# EAGLE schematic CAN_Shield_HS (EAGLE 7.5.0)
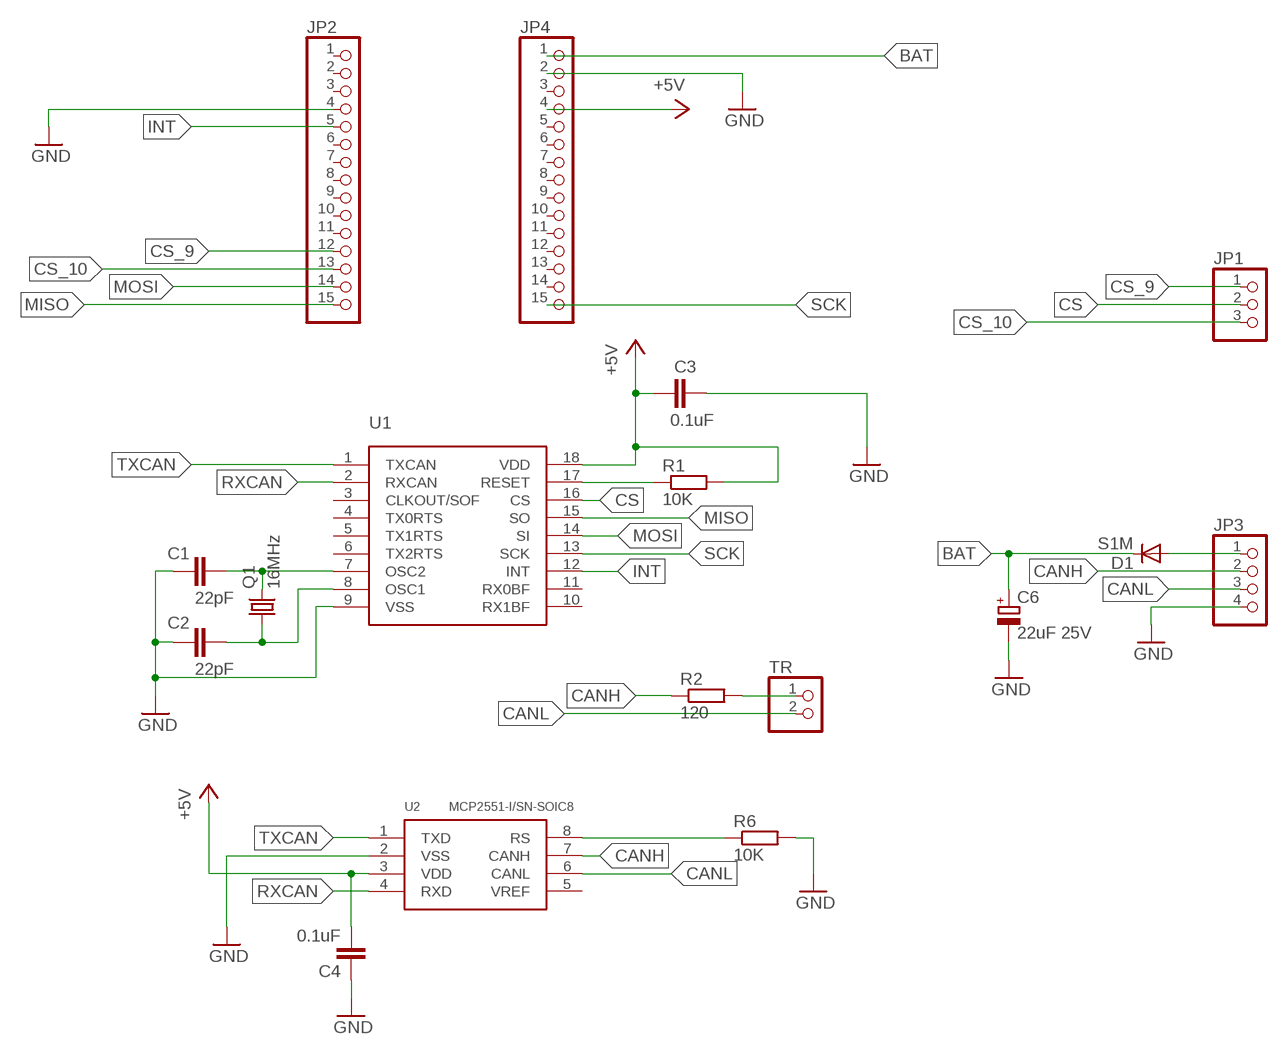
[diagram p0: schematic, sheet 1]

## Parts
C1  22pF  C-EUC0805  [C0805]
C2  22pF  C-EUC0805  [C0805]
C3  0.1uF  C-EUC0805  [C0805]
C4  0.1uF  C-EUC0805  [C0805]
C6  22uF 25V  CPOL-EUSMCC  [SMC_C]
D1  S1M  [SMA]
JP1  PINHD-1X3  [1X03]
JP2  PINHD-1X15  [1X15]
JP3  PINHD-1X4-1  [1X04]
JP4  PINHD-1X15  [1X15]
Q1  16MHz  CRYSTALHC49S  [HC49/S]
R1  10K  R-EU_R0805  [R0805]
R2  120  R-EU_R0805  [R0805]
R6  10K  R-EU_R0805  [R0805]
TR  PINHD-1X2  [1X02]
U1  MCP2515  [SO18-1]
U2  MCP2551-I/SN-SOIC8  INTERFACE-MCP2551-I/SN(SOIC8)  [SOIC8-1.27-5X4MM]

## Nets
+5V: C3.1 C4.2 JP4.4 R1.2 U1.18(VDD) U2.3(VDD)
BAT: C6.+ D1.C JP4.1
CANH: JP3.2 R2.1 U2.7(CANH)
CANL: JP3.3 TR.2 U2.6(CANL)
CS: JP1.2 U1.16(CS)
CS_9: JP1.1 JP2.12
CS_10: JP1.3 JP2.13
GND: C1.1 C2.1 C3.2 C4.1 C6.- JP2.4 JP3.4 JP4.2 R6.2 U1.9(VSS) U2.2(VSS)
INT: JP2.5 U1.12(INT)
MISO: JP2.15 U1.15(SO)
MOSI: JP2.14 U1.14(SI)
N$1: R2.2 TR.1
N$3: C1.2 Q1.2 U1.7(OSC2)
N$4: D1.A JP3.1
N$5: C2.2 Q1.1 U1.8(OSC1)
N$7: R1.1 U1.17(RESET)
N$12: R6.1 U2.8(RS)
RXCAN: U1.2(RXCAN) U2.4(RXD)
SCK: JP4.15 U1.13(SCK)
TXCAN: U1.1(TXCAN) U2.1(TXD)
Unconnected: JP2.1 JP2.2 JP2.3 JP2.6 JP2.7 JP2.8 JP2.9 JP2.10 JP2.11 JP4.3 JP4.5 JP4.6 JP4.7 JP4.8 JP4.9 JP4.10 JP4.11 JP4.12 JP4.13 JP4.14 U1.3(CLKOUT/SOF) U1.4(TX0RTS) U1.5(TX1RTS) U1.6(TX2RTS) U1.10(RX1BF) U1.11(RX0BF) U2.5(VREF)

## Library data of the parts
C1-C4 = rcl:C-EU: CAPACITOR, European symbol
C6 = rcl:CPOL-EU: POLARIZED CAPACITOR, European symbol
D1 = diode:S1M
JP1 = CAN_Shiel_Lib:PINHD-1X3: PIN HEADER
JP2 JP4 = CAN_Shiel_Lib:PINHD-1X15: PIN HEADER
JP3 = CAN_Shiel_Lib:PINHD-1X4-1: PIN HEADER
Q1 = crystal:CRYSTAL: CRYSTAL; OC_FARNELL: 1667008; OC_NEWARK: unknown
R1 R2 R6 = rcl:R-EU_: RESISTOR, European symbol
TR = CAN_Shiel_Lib:PINHD-1X2: PIN HEADER
U1 = CAN_Shiel_Lib:MCP2515
U2 = CAN_Shiel_Lib:INTERFACE-MCP2551-I/SN(SOIC8): 310070024; MPN: MCP2551-I/SN